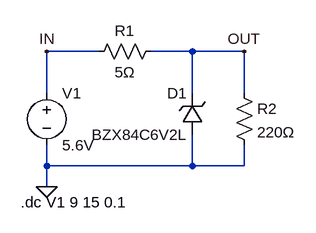
[diagram p0: schematic schematic.asc]
schematic.asc, the LTspice schematic file:
Version 4.1
SHEET 1 880 680
WIRE 144 32 64 32
WIRE 288 32 224 32
WIRE 368 32 288 32
WIRE 64 96 64 32
WIRE 288 96 288 32
WIRE 368 96 368 32
WIRE 64 208 64 176
WIRE 288 208 288 160
WIRE 288 208 64 208
WIRE 368 208 368 176
WIRE 368 208 288 208
WIRE 64 240 64 208
FLAG 64 240 0
FLAG 64 32 IN
FLAG 368 32 OUT
SYMBOL voltage 64 80 R0
SYMATTR InstName V1
SYMATTR Value 5.6V
SYMBOL res 240 16 R90
WINDOW 0 0 56 VBottom 2
WINDOW 3 32 56 VTop 2
SYMATTR InstName R1
SYMATTR Value 5Ω
SYMBOL zener 304 160 R180
WINDOW 0 24 64 Left 2
WINDOW 3 24 0 Left 2
SYMATTR InstName D1
SYMATTR Value BZX84C6V2L
SYMATTR Description Diode
SYMATTR Type diode
SYMBOL res 352 80 R0
SYMATTR InstName R2
SYMATTR Value 220Ω
TEXT 24 264 Left 2 !.dc V1 9 15 0.1

The netlist it stands for:
* schematic.asc
V1 IN 0 5.6V
R1 OUT IN 5Ω
D1 0 OUT BZX84C6V2L
R2 OUT 0 220Ω
.model D D
.lib standard.dio
.dc V1 9 15 0.1
.backanno
.end